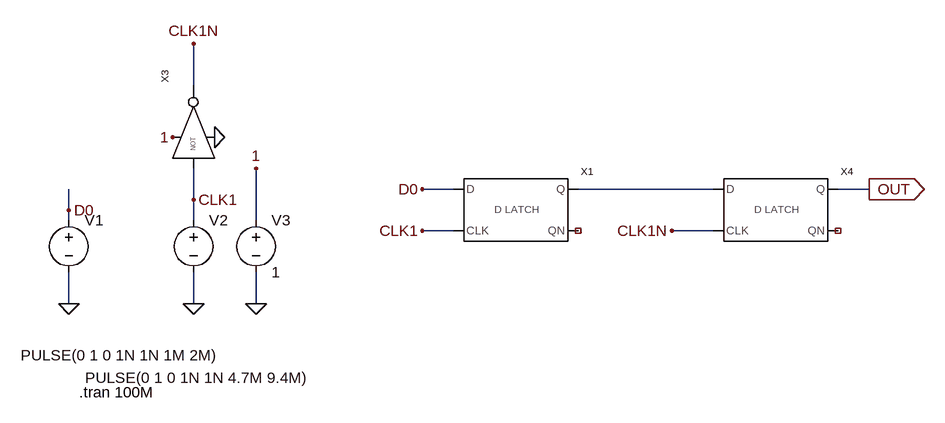
[diagram p0: schematic D_FLIPFLOP_USING_D_LATCH.asc]
D_FLIPFLOP_USING_D_LATCH.asc, the LTspice schematic file:
Version 4
SHEET 1 880 680
WIRE -352 -16 -352 -80
WIRE 48 144 0 144
WIRE 448 144 240 144
WIRE 688 144 640 144
WIRE -352 160 -352 112
WIRE -544 176 -544 144
WIRE -544 192 -544 176
WIRE -352 192 -352 160
WIRE -256 192 -256 112
WIRE 48 208 0 208
WIRE 448 208 384 208
WIRE -544 320 -544 272
WIRE -352 320 -352 272
WIRE -256 320 -256 272
FLAG -544 320 0
FLAG -352 320 0
FLAG -256 112 1
FLAG -544 176 D0
FLAG -352 -80 CLK1N
FLAG -256 320 0
FLAG -384 64 1
FLAG -320 64 0
FLAG 0 144 D0
FLAG 0 208 CLK1
FLAG -352 160 CLK1
FLAG 384 208 CLK1N
FLAG 688 144 OUT
IOPIN 688 144 Out
SYMBOL D_LATCH 128 176 R0
SYMATTR InstName X1
SYMBOL voltage -544 176 R0
WINDOW 3 -74 223 Left 2
WINDOW 123 0 0 Left 0
WINDOW 39 0 0 Left 0
SYMATTR Value PULSE(0 1 0 1N 1N 1M 2M)
SYMATTR InstName V1
SYMBOL voltage -352 176 R0
WINDOW 3 -167 258 Left 2
WINDOW 123 0 0 Left 0
WINDOW 39 0 0 Left 0
SYMATTR Value PULSE(0 1 0 1N 1N 4.7M 9.4M)
SYMATTR InstName V2
SYMBOL voltage -256 176 R0
WINDOW 123 0 0 Left 0
WINDOW 39 0 0 Left 0
SYMATTR InstName V3
SYMATTR Value 1
SYMBOL NOT4 -336 48 R270
SYMATTR InstName X3
SYMBOL D_LATCH 528 176 R0
SYMATTR InstName X4
TEXT -528 456 Left 2 !.tran 100M

The netlist it stands for:
* D_FLIPFLOP_USING_D_LATCH.asc
XX1 D0 CLK1 N001 NC_01 D_LATCH  ; pins D CLK Q QN
V1 D0 0 PULSE(0 1 0 1N 1N 1M 2M)
V2 CLK1 0 PULSE(0 1 0 1N 1N 4.7M 9.4M)
V3 1 0 1
XX3 CLK1 1 0 CLK1N NOT4  ; pins A VH VL OUT
XX4 N001 CLK1N OUT NC_02 D_LATCH  ; pins D CLK Q QN
.tran 100M
.backanno
.end

* Results of the author's LTspice run, read from the files saved beside the schematic
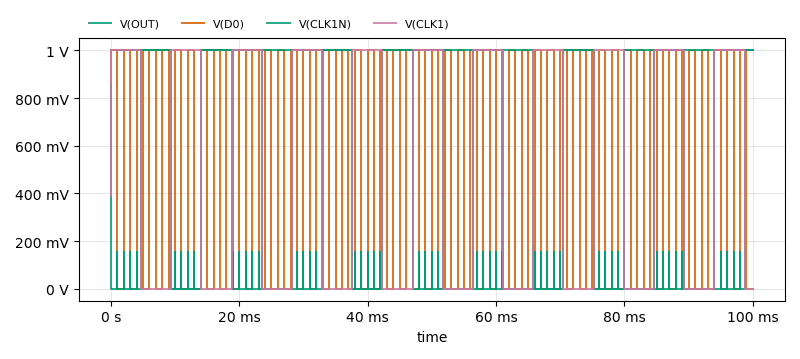
[diagram p1: Transient Analysis of D_FLIPFLOP_USING_D_LATCH.asc, plotted from the saved traces]
* Transient Analysis, 1 run:
*   V(OUT): min 0 V, max 1 V, average 577 mV, rms 759.6 mV, last 1 V
*   V(D0): min 0 V, max 1 V, average 500 mV, rms 707.1 mV, last 0 V
*   V(CLK1N): min -138.8 nV, max 1 V, average 483 mV, rms 695 mV, last 1 V
*   V(CLK1): min 0 V, max 1 V, average 517 mV, rms 719 mV, last 0 V